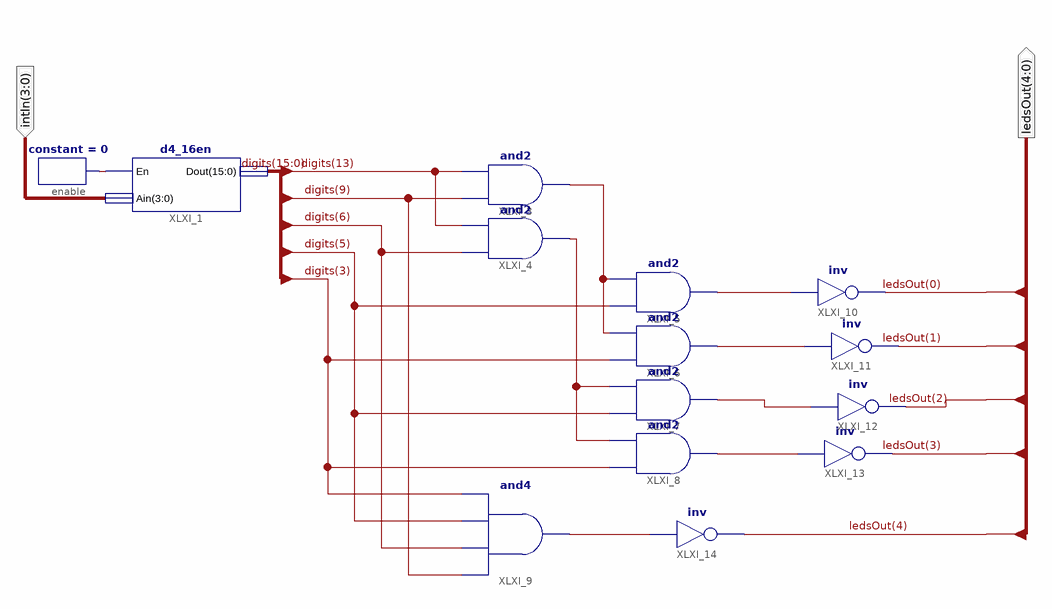
[diagram p0: schematic sheet 1]
// Xilinx ISE schematic Experiment1.sch (spartan3e) as structural Verilog: 14 symbols, 2 ports
module Experiment1 (
  input  [3:0] intIn,
  output [4:0] ledsOut
);

  wire XLXN_2, XLXN_11, XLXN_12, XLXN_24, XLXN_25, XLXN_26, XLXN_28, XLXN_30;
  wire [15:0] digits;

  constant #(.CValue("0")) enable (.O(XLXN_2));
  d4_16en XLXI_1 (.En(XLXN_2), .Ain(intIn), .Dout(digits));
  and XLXI_3 (XLXN_12, digits[9], digits[13]);
  and XLXI_4 (XLXN_11, digits[6], digits[13]);
  and XLXI_9 (XLXN_30, digits[9], digits[6], digits[5], digits[3]);
  and XLXI_5 (XLXN_24, digits[5], XLXN_12);
  and XLXI_6 (XLXN_25, digits[3], XLXN_12);
  and XLXI_7 (XLXN_26, digits[5], XLXN_11);
  and XLXI_8 (XLXN_28, digits[3], XLXN_11);
  not XLXI_10 (ledsOut[0], XLXN_24);
  not XLXI_11 (ledsOut[1], XLXN_25);
  not XLXI_12 (ledsOut[2], XLXN_26);
  not XLXI_13 (ledsOut[3], XLXN_28);
  not XLXI_14 (ledsOut[4], XLXN_30);
endmodule
